# EAGLE schematic ADS7947 Breakout (EAGLE 9.6.2)
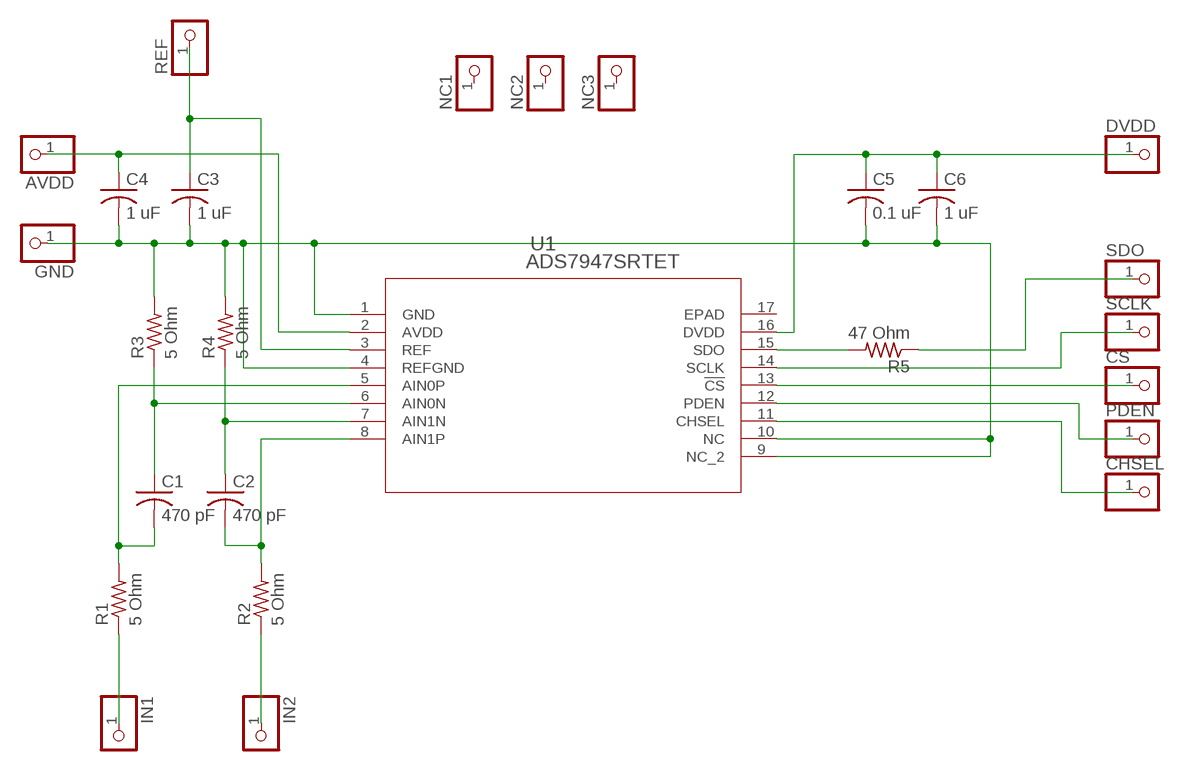
[diagram p0: schematic, sheet 1]

## Parts
AVDD  PINHD-1X1  [1X01]
C1  470 pF  C-USC0805  [C0805]
C2  470 pF  C-USC0805  [C0805]
C3  1 uF  C-USC0805  [C0805]
C4  1 uF  C-USC0805  [C0805]
C5  0.1 uF  C-USC0805  [C0805]
C6  1 uF  C-USC0805  [C0805]
CHSEL  PINHD-1X1  [1X01]
CS  PINHD-1X1  [1X01]
DVDD  PINHD-1X1  [1X01]
GND  PINHD-1X1  [1X01]
IN1  PINHD-1X1  [1X01]
IN2  PINHD-1X1  [1X01]
NC1  PINHD-1X1  [1X01]
NC2  PINHD-1X1  [1X01]
NC3  PINHD-1X1  [1X01]
PDEN  PINHD-1X1  [1X01]
R1  5 Ohm  R-US_R0805  [R0805]
R2  5 Ohm  R-US_R0805  [R0805]
R3  5 Ohm  R-US_R0805  [R0805]
R4  5 Ohm  R-US_R0805  [R0805]
R5  47 Ohm  R-US_R0805  [R0805]
REF  PINHD-1X1  [1X01]
SCLK  PINHD-1X1  [1X01]
SDO  PINHD-1X1  [1X01]
U1  ADS7947SRTET  [RTE16_1P7X1P7]

## Nets
N$1: IN2.1 R2.1
N$2: C2.2 R2.2 U1.8(AIN1P)
N$3: C1.2 R1.2 U1.5(AIN0P)
N$4: IN1.1 R1.1
N$5 [GND]: C3.2 C4.2 C5.2 C6.2 GND.1 R3.2 R4.2 U1.1(GND) U1.4(REFGND) U1.9(NC_2) U1.10(NC)
N$6: C2.1 R4.1 U1.7(AIN1N)
N$7: C1.1 R3.1 U1.6(AIN0N)
N$8: C3.1 REF.1 U1.3(REF)
N$9: AVDD.1 C4.1 U1.2(AVDD)
N$10: C5.1 C6.1 DVDD.1 U1.16(DVDD)
N$11: R5.2 U1.15(SDO)
N$12: R5.1 SDO.1
N$13: SCLK.1 U1.14(SCLK)
N$14: CS.1 U1.13(!CS)
N$15: PDEN.1 U1.12(PDEN)
N$16: CHSEL.1 U1.11(CHSEL)
Unconnected: NC1.1 NC2.1 NC3.1

## Power pins joined to a net without a drawn wire
EPAD: U1.17(EPAD)

## Library data of the parts
AVDD CHSEL CS DVDD GND IN1 IN2 NC1-NC3 PDEN REF SCLK SDO = pinhead:PINHD-1X1: PIN HEADER
C1-C6 = rcl:C-US: CAPACITOR, American symbol; SPICEPREFIX: C
R1-R5 = rcl:R-US_: RESISTOR, American symbol; SPICEPREFIX: R
U1 = ADS7947:ADS7947SRTET: ADS7947 12 Bit ADC; DATASHEET_URL: http://www.ti.com/lit/gpn/ADS7947; DESCRIPTION: 12-Bit, 2 MSPS, Dual Channel, Pseudo-differential uPower Serial SAR ADC; FAMILY_NAME: PRECISION ADC (<=10MSPS); GENERIC_PART_NUMBER: ADS7947; INDUSTRY_STD_PKG_TYPE: WQFN; MANUFACTURER: Texas Instruments; PACKAGE_DESIGNATOR: RTE; PIN_COUNT: 16